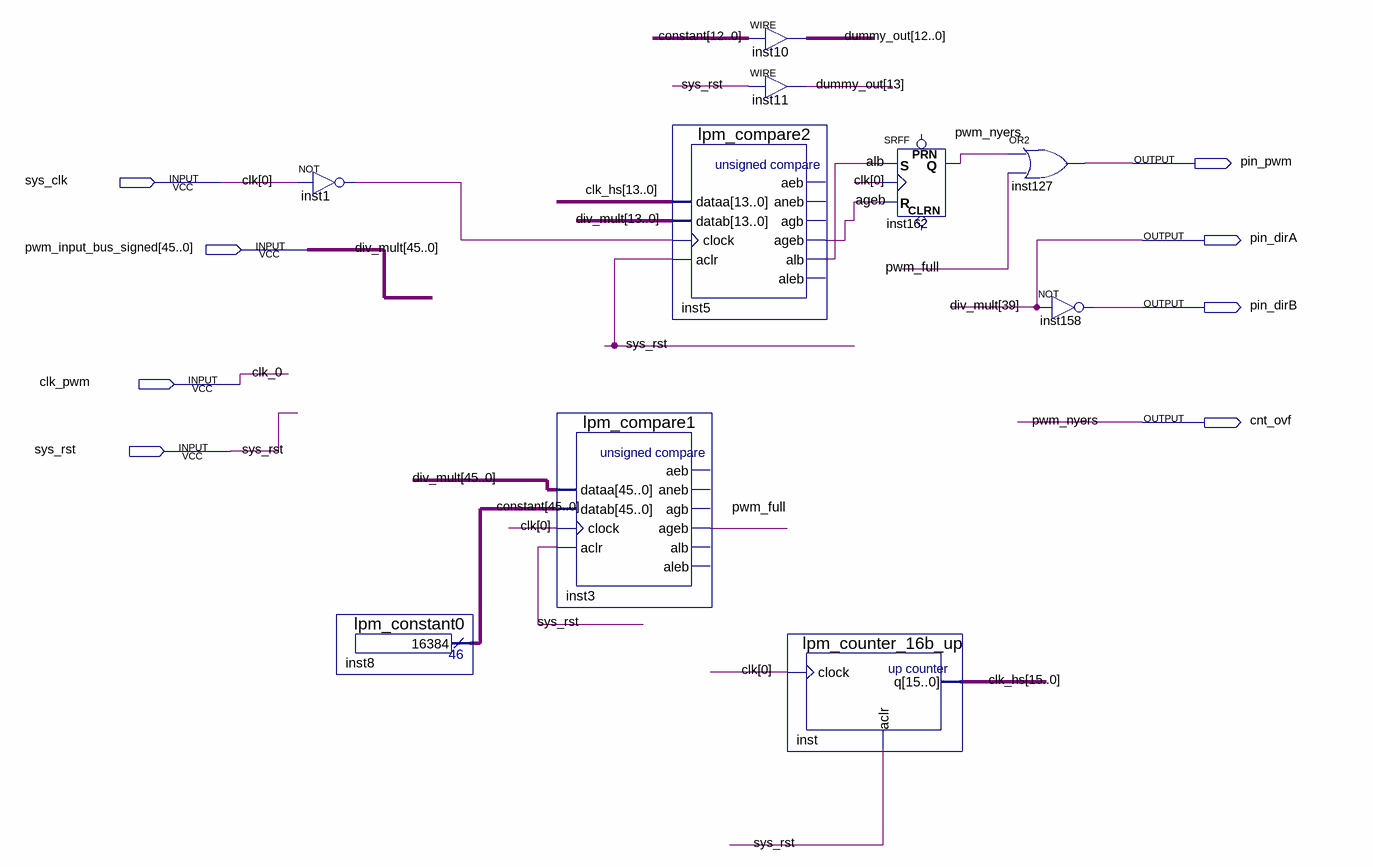
[diagram p0: schematic sheet]
// Quartus schematic pwm.bdf as structural Verilog: 10 symbols, 8 pins
module pwm (
  input  sys_clk,
  input  [45:0] pwm_input_bus_signed,
  input  clk_pwm,
  input  sys_rst,
  output pin_pwm,
  output pin_dirA,
  output pin_dirB,
  output cnt_ovf
);

  wire ageb, alb, inst1_out, pwm_full;
  wire [13:0] dummy_out;
  wire [15:0] clk_hs;
  wire [45:0] constant;

  not inst1 (inst1_out, sys_clk);
  lpm_constant0 inst8 (.result(constant));
  lpm_compare1 inst3 (
    .dataa(pwm_input_bus_signed), .datab(constant), .clock(sys_clk), .aclr(sys_rst), .ageb(pwm_full));  // open: aeb, aneb, agb, alb, aleb
  lpm_compare2 inst5 (
    .dataa(clk_hs[13:0]), .datab(pwm_input_bus_signed[13:0]), .clock(inst1_out), .aclr(sys_rst), .ageb(ageb),
    .alb(alb));  // open: aeb, aneb, agb, aleb
  assign dummy_out[12:0] = constant[12:0];  // WIRE inst10
  assign dummy_out[13] = sys_rst;  // WIRE inst11
  lpm_counter_16b_up inst (.clock(sys_clk), .aclr(sys_rst), .q(clk_hs));
  SRFF inst162 (.S(alb), .R(ageb), .CLK(sys_clk), .Q(cnt_ovf));  // open: PRN, CLRN
  or inst127 (pin_pwm, cnt_ovf, pwm_full);
  not inst158 (pin_dirB, pwm_input_bus_signed[39]);

  assign pin_dirA = pwm_input_bus_signed[39];

  // Other names for the same wires on the sheet: clk[0] = sys_clk; clk_0 = clk_pwm;
  //   div_mult[45:0] = pwm_input_bus_signed; pwm_nyers = cnt_ovf
endmodule
